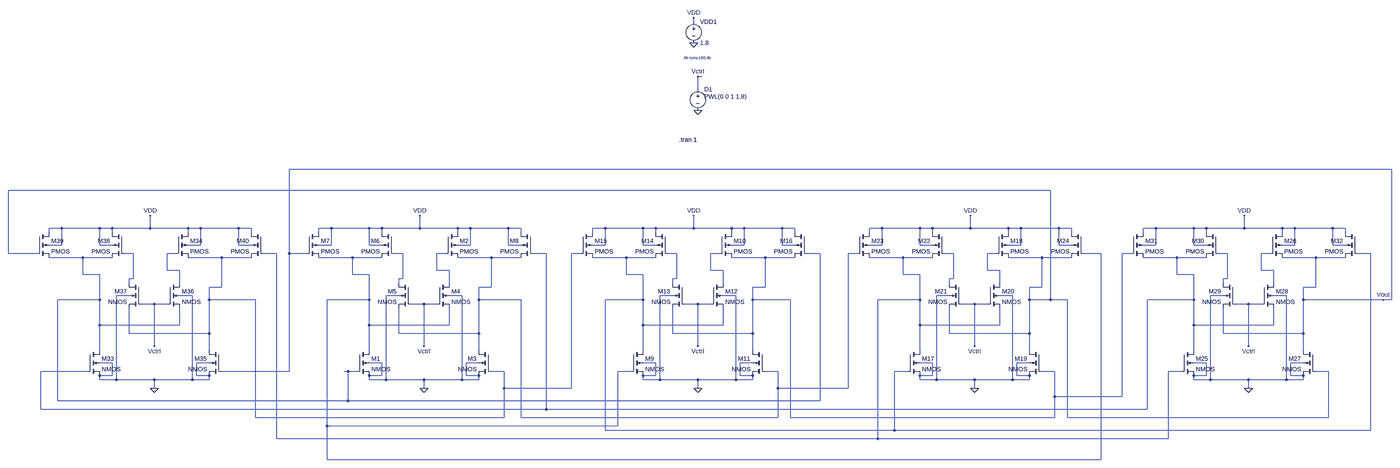
[diagram p0: schematic VCO3.asc, whole sheet]
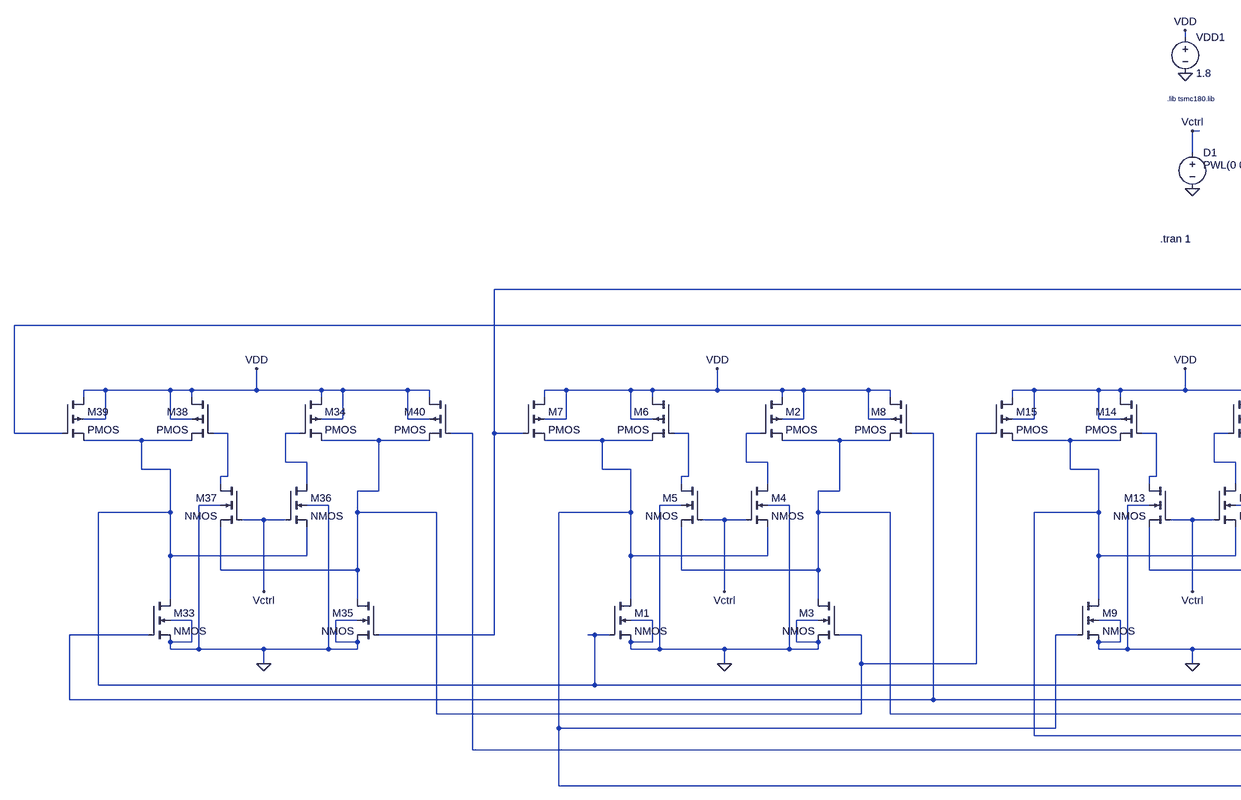
[diagram p1: schematic VCO3.asc, part, row 1 of 1, column 1 of 2]
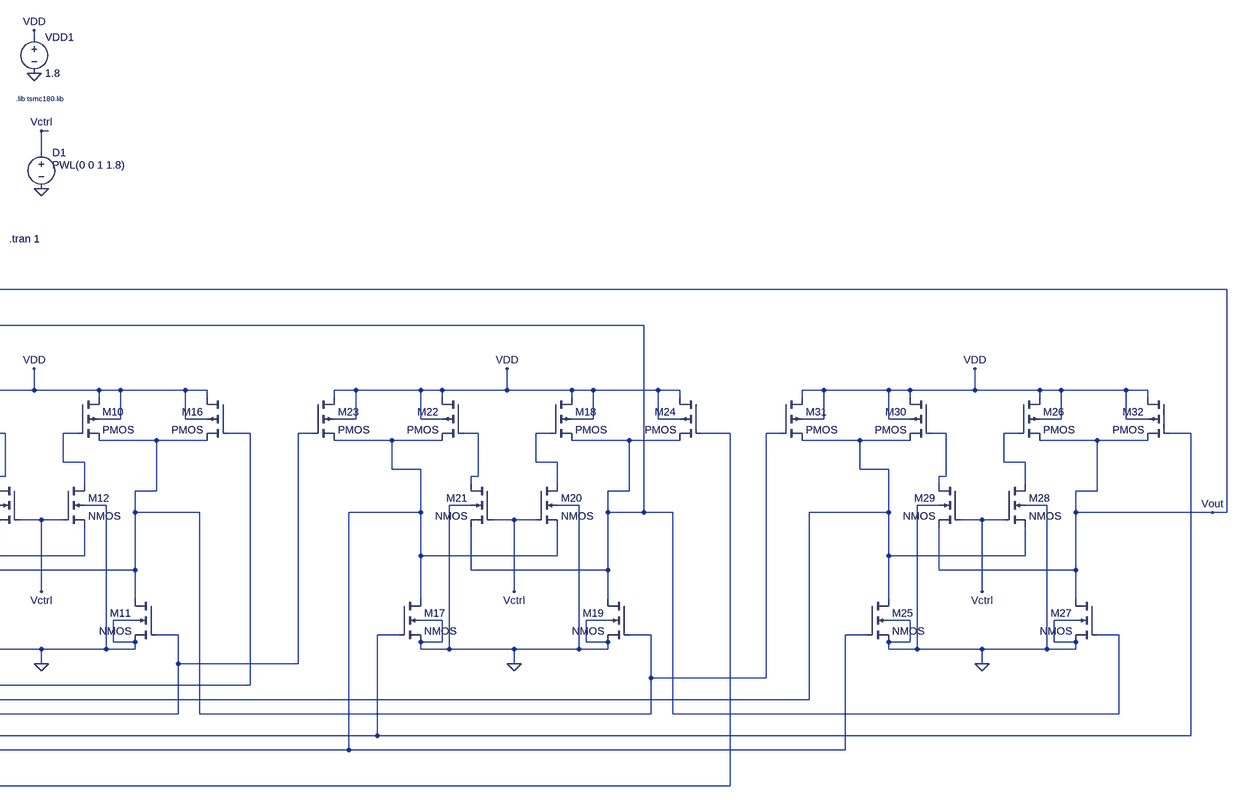
[diagram p2: schematic VCO3.asc, part, row 1 of 1, column 2 of 2]
VCO3.asc, the LTspice schematic file:
Version 4
SHEET 1 4028 680
WIRE 1360 -1632 1360 -1648
WIRE 1392 -1424 1376 -1424
WIRE 1376 -1376 1376 -1424
WIRE 4016 -528 -176 -528
WIRE 2720 -448 -1264 -448
WIRE -1040 -304 -1088 -304
WIRE -896 -304 -1040 -304
WIRE -848 -304 -896 -304
WIRE -704 -304 -704 -352
WIRE -704 -304 -848 -304
WIRE -560 -304 -704 -304
WIRE -512 -304 -560 -304
WIRE -368 -304 -512 -304
WIRE -320 -304 -368 -304
WIRE -16 -304 -64 -304
WIRE 128 -304 -16 -304
WIRE 176 -304 128 -304
WIRE 320 -304 320 -352
WIRE 320 -304 176 -304
WIRE 464 -304 320 -304
WIRE 512 -304 464 -304
WIRE 656 -304 512 -304
WIRE 704 -304 656 -304
WIRE 1024 -304 976 -304
WIRE 1168 -304 1024 -304
WIRE 1216 -304 1168 -304
WIRE 1360 -304 1360 -352
WIRE 1360 -304 1216 -304
WIRE 1504 -304 1360 -304
WIRE 1552 -304 1504 -304
WIRE 1696 -304 1552 -304
WIRE 1744 -304 1696 -304
WIRE 2080 -304 2032 -304
WIRE 2224 -304 2080 -304
WIRE 2272 -304 2224 -304
WIRE 2416 -304 2416 -352
WIRE 2416 -304 2272 -304
WIRE 2560 -304 2416 -304
WIRE 2608 -304 2560 -304
WIRE 2752 -304 2608 -304
WIRE 2800 -304 2752 -304
WIRE 3120 -304 3072 -304
WIRE 3264 -304 3120 -304
WIRE 3312 -304 3264 -304
WIRE 3456 -304 3456 -352
WIRE 3456 -304 3312 -304
WIRE 3600 -304 3456 -304
WIRE 3648 -304 3600 -304
WIRE 3792 -304 3648 -304
WIRE 3840 -304 3792 -304
WIRE -1088 -288 -1088 -304
WIRE -848 -288 -848 -304
WIRE -560 -288 -560 -304
WIRE -320 -288 -320 -304
WIRE -64 -288 -64 -304
WIRE 176 -288 176 -304
WIRE 464 -288 464 -304
WIRE 704 -288 704 -304
WIRE 976 -288 976 -304
WIRE 1216 -288 1216 -304
WIRE 1504 -288 1504 -304
WIRE 1744 -288 1744 -304
WIRE 2032 -288 2032 -304
WIRE 2272 -288 2272 -304
WIRE 2560 -288 2560 -304
WIRE 2800 -288 2800 -304
WIRE 3072 -288 3072 -304
WIRE 3312 -288 3312 -304
WIRE 3600 -288 3600 -304
WIRE 3840 -288 3840 -304
WIRE -1040 -240 -1040 -304
WIRE -1040 -240 -1088 -240
WIRE -896 -240 -896 -304
WIRE -848 -240 -896 -240
WIRE -512 -240 -512 -304
WIRE -512 -240 -560 -240
WIRE -368 -240 -368 -304
WIRE -320 -240 -368 -240
WIRE -16 -240 -16 -304
WIRE -16 -240 -64 -240
WIRE 128 -240 128 -304
WIRE 176 -240 128 -240
WIRE 512 -240 512 -304
WIRE 512 -240 464 -240
WIRE 656 -240 656 -304
WIRE 704 -240 656 -240
WIRE 1024 -240 1024 -304
WIRE 1024 -240 976 -240
WIRE 1168 -240 1168 -304
WIRE 1216 -240 1168 -240
WIRE 1552 -240 1552 -304
WIRE 1552 -240 1504 -240
WIRE 1696 -240 1696 -304
WIRE 1744 -240 1696 -240
WIRE 2080 -240 2080 -304
WIRE 2080 -240 2032 -240
WIRE 2224 -240 2224 -304
WIRE 2272 -240 2224 -240
WIRE 2608 -240 2608 -304
WIRE 2608 -240 2560 -240
WIRE 2752 -240 2752 -304
WIRE 2800 -240 2752 -240
WIRE 3120 -240 3120 -304
WIRE 3120 -240 3072 -240
WIRE 3264 -240 3264 -304
WIRE 3312 -240 3264 -240
WIRE 3648 -240 3648 -304
WIRE 3648 -240 3600 -240
WIRE 3792 -240 3792 -304
WIRE 3840 -240 3792 -240
WIRE -1264 -208 -1264 -448
WIRE -1136 -208 -1264 -208
WIRE -768 -208 -800 -208
WIRE -608 -208 -640 -208
WIRE -224 -208 -272 -208
WIRE -176 -208 -176 -528
WIRE -112 -208 -176 -208
WIRE 256 -208 224 -208
WIRE 416 -208 384 -208
WIRE 800 -208 752 -208
WIRE 928 -208 896 -208
WIRE 1296 -208 1264 -208
WIRE 1456 -208 1424 -208
WIRE 1840 -208 1792 -208
WIRE 1984 -208 1952 -208
WIRE 2352 -208 2320 -208
WIRE 2512 -208 2480 -208
WIRE 2912 -208 2848 -208
WIRE 3024 -208 2992 -208
WIRE 3392 -208 3360 -208
WIRE 3552 -208 3520 -208
WIRE 3936 -208 3888 -208
WIRE -960 -192 -1088 -192
WIRE -848 -192 -960 -192
WIRE -432 -192 -560 -192
WIRE -320 -192 -432 -192
WIRE 64 -192 -64 -192
WIRE 176 -192 64 -192
WIRE 592 -192 464 -192
WIRE 704 -192 592 -192
WIRE 1104 -192 976 -192
WIRE 1216 -192 1104 -192
WIRE 1632 -192 1504 -192
WIRE 1744 -192 1632 -192
WIRE 2160 -192 2032 -192
WIRE 2272 -192 2160 -192
WIRE 2688 -192 2560 -192
WIRE 2800 -192 2688 -192
WIRE 3200 -192 3072 -192
WIRE 3312 -192 3200 -192
WIRE 3728 -192 3600 -192
WIRE 3840 -192 3728 -192
WIRE -640 -144 -640 -208
WIRE -592 -144 -640 -144
WIRE 384 -144 384 -208
WIRE 432 -144 384 -144
WIRE 1424 -144 1424 -208
WIRE 1472 -144 1424 -144
WIRE 2480 -144 2480 -208
WIRE 2528 -144 2480 -144
WIRE 3520 -144 3520 -208
WIRE 3568 -144 3520 -144
WIRE -960 -128 -960 -192
WIRE -896 -128 -960 -128
WIRE 64 -128 64 -192
WIRE 128 -128 64 -128
WIRE 1104 -128 1104 -192
WIRE 1168 -128 1104 -128
WIRE 2160 -128 2160 -192
WIRE 2224 -128 2160 -128
WIRE 3200 -128 3200 -192
WIRE 3264 -128 3200 -128
WIRE -768 -112 -768 -208
WIRE -768 -112 -784 -112
WIRE 256 -112 256 -208
WIRE 256 -112 240 -112
WIRE 1296 -112 1296 -208
WIRE 1296 -112 1280 -112
WIRE 2352 -112 2352 -208
WIRE 2352 -112 2336 -112
WIRE 3392 -112 3392 -208
WIRE 3392 -112 3376 -112
WIRE -784 -96 -784 -112
WIRE -592 -96 -592 -144
WIRE 240 -96 240 -112
WIRE 432 -96 432 -144
WIRE 1280 -96 1280 -112
WIRE 1472 -96 1472 -144
WIRE 2336 -96 2336 -112
WIRE 2528 -96 2528 -144
WIRE 3376 -96 3376 -112
WIRE 3568 -96 3568 -144
WIRE -432 -80 -432 -192
WIRE -432 -80 -480 -80
WIRE 592 -80 592 -192
WIRE 592 -80 544 -80
WIRE 1632 -80 1632 -192
WIRE 1632 -80 1584 -80
WIRE 2688 -80 2688 -192
WIRE 2688 -80 2640 -80
WIRE 3728 -80 3728 -192
WIRE 3728 -80 3680 -80
WIRE -784 -48 -832 -48
WIRE -544 -48 -592 -48
WIRE 240 -48 192 -48
WIRE 480 -48 432 -48
WIRE 1280 -48 1232 -48
WIRE 1520 -48 1472 -48
WIRE 2336 -48 2288 -48
WIRE 2576 -48 2528 -48
WIRE 3376 -48 3328 -48
WIRE 3616 -48 3568 -48
WIRE -896 -32 -896 -128
WIRE -896 -32 -1056 -32
WIRE -480 -32 -480 -80
WIRE -304 -32 -480 -32
WIRE 128 -32 128 -128
WIRE 128 -32 -32 -32
WIRE 544 -32 544 -80
WIRE 704 -32 544 -32
WIRE 1168 -32 1168 -128
WIRE 1168 -32 1024 -32
WIRE 1584 -32 1584 -80
WIRE 1728 -32 1584 -32
WIRE 2224 -32 2224 -128
WIRE 2224 -32 2064 -32
WIRE 2640 -32 2640 -80
WIRE 2720 -32 2720 -448
WIRE 2720 -32 2640 -32
WIRE 2784 -32 2720 -32
WIRE 3264 -32 3264 -128
WIRE 3264 -32 3088 -32
WIRE 3680 -32 3680 -80
WIRE 3984 -32 3680 -32
WIRE 4016 -32 4016 -528
WIRE 4016 -32 3984 -32
WIRE -688 -16 -736 -16
WIRE -640 -16 -688 -16
WIRE 336 -16 288 -16
WIRE 384 -16 336 -16
WIRE 1376 -16 1328 -16
WIRE 1424 -16 1376 -16
WIRE 2432 -16 2384 -16
WIRE 2480 -16 2432 -16
WIRE 3472 -16 3424 -16
WIRE 3520 -16 3472 -16
WIRE -896 64 -896 -32
WIRE -592 64 -592 0
WIRE -592 64 -896 64
WIRE 128 64 128 -32
WIRE 432 64 432 0
WIRE 432 64 128 64
WIRE 1168 64 1168 -32
WIRE 1472 64 1472 0
WIRE 1472 64 1168 64
WIRE 2224 64 2224 -32
WIRE 2528 64 2528 0
WIRE 2528 64 2224 64
WIRE 3264 64 3264 -32
WIRE 3568 64 3568 0
WIRE 3568 64 3264 64
WIRE -784 96 -784 0
WIRE -480 96 -480 -32
WIRE -480 96 -784 96
WIRE 240 96 240 0
WIRE 544 96 544 -32
WIRE 544 96 240 96
WIRE 1280 96 1280 0
WIRE 1584 96 1584 -32
WIRE 1584 96 1280 96
WIRE 2336 96 2336 0
WIRE 2640 96 2640 -32
WIRE 2640 96 2336 96
WIRE 3376 96 3376 0
WIRE 3680 96 3680 -32
WIRE 3680 96 3376 96
WIRE -688 144 -688 -16
WIRE 336 144 336 -16
WIRE 1376 144 1376 -16
WIRE 2432 144 2432 -16
WIRE 3472 144 3472 -16
WIRE -896 160 -896 64
WIRE -480 160 -480 96
WIRE 128 160 128 64
WIRE 544 160 544 96
WIRE 1168 160 1168 64
WIRE 1584 160 1584 96
WIRE 2224 160 2224 64
WIRE 2640 160 2640 96
WIRE 3264 160 3264 64
WIRE 3680 160 3680 96
WIRE -848 208 -896 208
WIRE -480 208 -528 208
WIRE 176 208 128 208
WIRE 544 208 496 208
WIRE 1216 208 1168 208
WIRE 1584 208 1536 208
WIRE 2272 208 2224 208
WIRE 2640 208 2592 208
WIRE 3312 208 3264 208
WIRE 3680 208 3632 208
WIRE -944 240 -1120 240
WIRE -176 240 -176 -208
WIRE -176 240 -432 240
WIRE 48 240 32 240
WIRE 80 240 48 240
WIRE 640 240 592 240
WIRE 1120 240 1072 240
WIRE 1680 240 1632 240
WIRE 2176 240 2128 240
WIRE 2736 240 2688 240
WIRE 3216 240 3168 240
WIRE 3776 240 3728 240
WIRE -848 256 -848 208
WIRE -848 256 -896 256
WIRE -528 256 -528 208
WIRE -480 256 -528 256
WIRE 176 256 176 208
WIRE 176 256 128 256
WIRE 496 256 496 208
WIRE 544 256 496 256
WIRE 1216 256 1216 208
WIRE 1216 256 1168 256
WIRE 1536 256 1536 208
WIRE 1584 256 1536 256
WIRE 2272 256 2272 208
WIRE 2272 256 2224 256
WIRE 2592 256 2592 208
WIRE 2640 256 2592 256
WIRE 3312 256 3312 208
WIRE 3312 256 3264 256
WIRE 3632 256 3632 208
WIRE 3680 256 3632 256
WIRE -896 272 -896 256
WIRE -832 272 -832 -48
WIRE -832 272 -896 272
WIRE -688 272 -832 272
WIRE -544 272 -544 -48
WIRE -544 272 -688 272
WIRE -480 272 -480 256
WIRE -480 272 -544 272
WIRE 128 272 128 256
WIRE 192 272 192 -48
WIRE 192 272 128 272
WIRE 336 272 192 272
WIRE 480 272 480 -48
WIRE 480 272 336 272
WIRE 544 272 544 256
WIRE 544 272 480 272
WIRE 1168 272 1168 256
WIRE 1232 272 1232 -48
WIRE 1232 272 1168 272
WIRE 1376 272 1232 272
WIRE 1520 272 1520 -48
WIRE 1520 272 1376 272
WIRE 1584 272 1584 256
WIRE 1584 272 1520 272
WIRE 2224 272 2224 256
WIRE 2288 272 2288 -48
WIRE 2288 272 2224 272
WIRE 2432 272 2288 272
WIRE 2576 272 2576 -48
WIRE 2576 272 2432 272
WIRE 2640 272 2640 256
WIRE 2640 272 2576 272
WIRE 3264 272 3264 256
WIRE 3328 272 3328 -48
WIRE 3328 272 3264 272
WIRE 3472 272 3328 272
WIRE 3616 272 3616 -48
WIRE 3616 272 3472 272
WIRE 3680 272 3680 256
WIRE 3680 272 3616 272
WIRE -688 304 -688 272
WIRE 336 304 336 272
WIRE 640 304 640 240
WIRE 896 304 896 -208
WIRE 896 304 640 304
WIRE 1376 304 1376 272
WIRE 1680 304 1680 240
WIRE 1952 304 1952 -208
WIRE 1952 304 1680 304
WIRE 2432 304 2432 272
WIRE 3472 304 3472 272
WIRE 2736 336 2736 240
WIRE 2992 336 2992 -208
WIRE 2992 336 2736 336
WIRE -1056 352 -1056 -32
WIRE 48 352 48 240
WIRE 48 352 -1056 352
WIRE 1840 352 1840 -208
WIRE 1840 352 48 352
WIRE -1120 384 -1120 240
WIRE 800 384 800 -208
WIRE 800 384 -1120 384
WIRE 3088 384 3088 -32
WIRE 3088 384 800 384
WIRE -304 416 -304 -32
WIRE 640 416 640 304
WIRE 640 416 -304 416
WIRE 704 416 704 -32
WIRE 1680 416 1680 304
WIRE 1680 416 704 416
WIRE 1728 416 1728 -32
WIRE 2736 416 2736 336
WIRE 2736 416 1728 416
WIRE 2784 416 2784 -32
WIRE 3776 416 3776 240
WIRE 3776 416 2784 416
WIRE -32 448 -32 -32
WIRE 1072 448 1072 240
WIRE 1072 448 -32 448
WIRE 1024 464 1024 -32
WIRE 2128 464 2128 240
WIRE 2128 464 1024 464
WIRE 3936 464 3936 -208
WIRE 3936 464 2128 464
WIRE -224 496 -224 -208
WIRE 2064 496 2064 -32
WIRE 2064 496 -224 496
WIRE 3168 496 3168 240
WIRE 3168 496 2064 496
WIRE -32 576 -32 448
WIRE 2912 576 2912 -208
WIRE 2912 576 -32 576
FLAG 336 304 0
FLAG 1376 -1296 0
FLAG 1360 -1552 0
FLAG 1360 -1648 VDD
FLAG 1376 -1424 Vctrl
FLAG 320 -352 VDD
FLAG 336 144 Vctrl
FLAG 1376 304 0
FLAG 1360 -352 VDD
FLAG 1376 144 Vctrl
FLAG 2432 304 0
FLAG 2416 -352 VDD
FLAG 2432 144 Vctrl
FLAG 3472 304 0
FLAG 3456 -352 VDD
FLAG 3472 144 Vctrl
FLAG -688 304 0
FLAG -704 -352 VDD
FLAG -688 144 Vctrl
FLAG 3984 -32 Vout
SYMBOL nmos4 80 160 R0
SYMATTR InstName M1
SYMATTR Value2 l=400n w=12u
SYMBOL pmos4 416 -288 R0
SYMATTR InstName M2
SYMATTR Value2 l=600n w=1u
SYMBOL nmos4 592 160 M0
SYMATTR InstName M3
SYMATTR Value2 l=400n w=12u
SYMBOL nmos4 384 -96 R0
SYMATTR InstName M4
SYMATTR Value2 l=1u w=1u
SYMBOL nmos4 288 -96 M0
SYMATTR InstName M5
SYMATTR Value2 l=1u w=1u
SYMBOL pmos4 224 -288 M0
SYMATTR InstName M6
SYMATTR Value2 l=600n w=1u
SYMBOL voltage 1376 -1392 R0
WINDOW 123 0 0 Left 0
WINDOW 39 24 124 Left 2
WINDOW 3 24 44 Left 2
SYMATTR Value PWL(0 0 1 1.8)
SYMATTR InstName D1
SYMBOL voltage 1360 -1648 R0
WINDOW 123 0 0 Left 0
WINDOW 39 24 124 Left 2
SYMATTR InstName VDD1
SYMATTR Value 1.8
SYMBOL pmos4 -112 -288 R0
SYMATTR InstName M7
SYMATTR Value2 l=400n w=15u
SYMBOL pmos4 752 -288 M0
SYMATTR InstName M8
SYMATTR Value2 l=400n w=15u
SYMBOL nmos4 1120 160 R0
SYMATTR InstName M9
SYMATTR Value2 l=400n w=12u
SYMBOL pmos4 1456 -288 R0
SYMATTR InstName M10
SYMATTR Value2 l=600n w=1u
SYMBOL nmos4 1632 160 M0
SYMATTR InstName M11
SYMATTR Value2 l=400n w=12u
SYMBOL nmos4 1424 -96 R0
SYMATTR InstName M12
SYMATTR Value2 l=1u w=1u
SYMBOL nmos4 1328 -96 M0
SYMATTR InstName M13
SYMATTR Value2 l=1u w=1u
SYMBOL pmos4 1264 -288 M0
SYMATTR InstName M14
SYMATTR Value2 l=600n w=1u
SYMBOL pmos4 928 -288 R0
SYMATTR InstName M15
SYMATTR Value2 l=400n w=15u
SYMBOL pmos4 1792 -288 M0
SYMATTR InstName M16
SYMATTR Value2 l=400n w=15u
SYMBOL nmos4 2176 160 R0
SYMATTR InstName M17
SYMATTR Value2 l=400n w=12u
SYMBOL pmos4 2512 -288 R0
SYMATTR InstName M18
SYMATTR Value2 l=600n w=1u
SYMBOL nmos4 2688 160 M0
SYMATTR InstName M19
SYMATTR Value2 l=400n w=12u
SYMBOL nmos4 2480 -96 R0
SYMATTR InstName M20
SYMATTR Value2 l=1u w=1u
SYMBOL nmos4 2384 -96 M0
SYMATTR InstName M21
SYMATTR Value2 l=1u w=1u
SYMBOL pmos4 2320 -288 M0
SYMATTR InstName M22
SYMATTR Value2 l=600n w=1u
SYMBOL pmos4 1984 -288 R0
SYMATTR InstName M23
SYMATTR Value2 l=400n w=15u
SYMBOL pmos4 2848 -288 M0
SYMATTR InstName M24
SYMATTR Value2 l=400n w=15u
SYMBOL nmos4 3216 160 R0
SYMATTR InstName M25
SYMATTR Value2 l=400n w=12u
SYMBOL pmos4 3552 -288 R0
SYMATTR InstName M26
SYMATTR Value2 l=600n w=1u
SYMBOL nmos4 3728 160 M0
SYMATTR InstName M27
SYMATTR Value2 l=400n w=12u
SYMBOL nmos4 3520 -96 R0
SYMATTR InstName M28
SYMATTR Value2 l=1u w=1u
SYMBOL nmos4 3424 -96 M0
SYMATTR InstName M29
SYMATTR Value2 l=1u w=1u
SYMBOL pmos4 3360 -288 M0
SYMATTR InstName M30
SYMATTR Value2 l=600n w=1u
SYMBOL pmos4 3024 -288 R0
SYMATTR InstName M31
SYMATTR Value2 l=400n w=15u
SYMBOL pmos4 3888 -288 M0
SYMATTR InstName M32
SYMATTR Value2 l=400n w=15u
SYMBOL nmos4 -944 160 R0
SYMATTR InstName M33
SYMATTR Value2 l=400n w=12u
SYMBOL pmos4 -608 -288 R0
SYMATTR InstName M34
SYMATTR Value2 l=600n w=1u
SYMBOL nmos4 -432 160 M0
SYMATTR InstName M35
SYMATTR Value2 l=400n w=12u
SYMBOL nmos4 -640 -96 R0
SYMATTR InstName M36
SYMATTR Value2 l=1u w=1u
SYMBOL nmos4 -736 -96 M0
SYMATTR InstName M37
SYMATTR Value2 l=1u w=1u
SYMBOL pmos4 -800 -288 M0
SYMATTR InstName M38
SYMATTR Value2 l=600n w=1u
SYMBOL pmos4 -1136 -288 R0
SYMATTR InstName M39
SYMATTR Value2 l=400n w=15u
SYMBOL pmos4 -272 -288 M0
SYMATTR InstName M40
SYMATTR Value2 l=400n w=15u
TEXT 1304 -1184 Left 2 !.tran 1
TEXT 1320 -1496 Left 1 !.lib tsmc180.lib

The netlist it stands for:
* VCO3.asc
M1 N015 N011 0 0 NMOS l=400n w=12u
M2 VDD N006 N012 VDD PMOS l=600n w=1u
M3 N012 N008 0 0 NMOS l=400n w=12u
M4 N006 Vctrl N015 0 NMOS l=1u w=1u
M5 N005 Vctrl N012 0 NMOS l=1u w=1u
M6 VDD N005 N015 VDD PMOS l=600n w=1u
V§D1 Vctrl 0 PWL(0 0 1 1.8)
VDD1 VDD 0 1.8
M7 VDD Vout N015 VDD PMOS l=400n w=15u
M8 VDD N007 N012 VDD PMOS l=400n w=15u
M9 N019 N015 0 0 NMOS l=400n w=12u
M10 VDD N010 N016 VDD PMOS l=600n w=1u
M11 N016 N012 0 0 NMOS l=400n w=12u
M12 N010 Vctrl N019 0 NMOS l=1u w=1u
M13 N009 Vctrl N016 0 NMOS l=1u w=1u
M14 VDD N009 N019 VDD PMOS l=600n w=1u
M15 VDD N008 N019 VDD PMOS l=400n w=15u
M16 VDD N011 N016 VDD PMOS l=400n w=15u
M17 N004 N019 0 0 NMOS l=400n w=12u
M18 VDD N014 N001 VDD PMOS l=600n w=1u
M19 N001 N016 0 0 NMOS l=400n w=12u
M20 N014 Vctrl N004 0 NMOS l=1u w=1u
M21 N013 Vctrl N001 0 NMOS l=1u w=1u
M22 VDD N013 N004 VDD PMOS l=600n w=1u
M23 VDD N012 N004 VDD PMOS l=400n w=15u
M24 VDD N015 N001 VDD PMOS l=400n w=15u
M25 N007 N004 0 0 NMOS l=400n w=12u
M26 VDD N018 Vout VDD PMOS l=600n w=1u
M27 Vout N001 0 0 NMOS l=400n w=12u
M28 N018 Vctrl N007 0 NMOS l=1u w=1u
M29 N017 Vctrl Vout 0 NMOS l=1u w=1u
M30 VDD N017 N007 VDD PMOS l=600n w=1u
M31 VDD N016 N007 VDD PMOS l=400n w=15u
M32 VDD N019 Vout VDD PMOS l=400n w=15u
M33 N011 N007 0 0 NMOS l=400n w=12u
M34 VDD N003 N008 VDD PMOS l=600n w=1u
M35 N008 Vout 0 0 NMOS l=400n w=12u
M36 N003 Vctrl N011 0 NMOS l=1u w=1u
M37 N002 Vctrl N008 0 NMOS l=1u w=1u
M38 VDD N002 N011 VDD PMOS l=600n w=1u
M39 VDD N001 N011 VDD PMOS l=400n w=15u
M40 VDD N004 N008 VDD PMOS l=400n w=15u
.model NMOS NMOS
.model PMOS PMOS
.lib standard.mos
.tran 1
.lib tsmc180.lib
.backanno
.end